# EasyEDA schematic SCH_gibran_2026-04-14.json
TITLE: gibran; REV: 1.0; Date: 2026-03-31; Sheet: 1/1; Company: teknik elektro
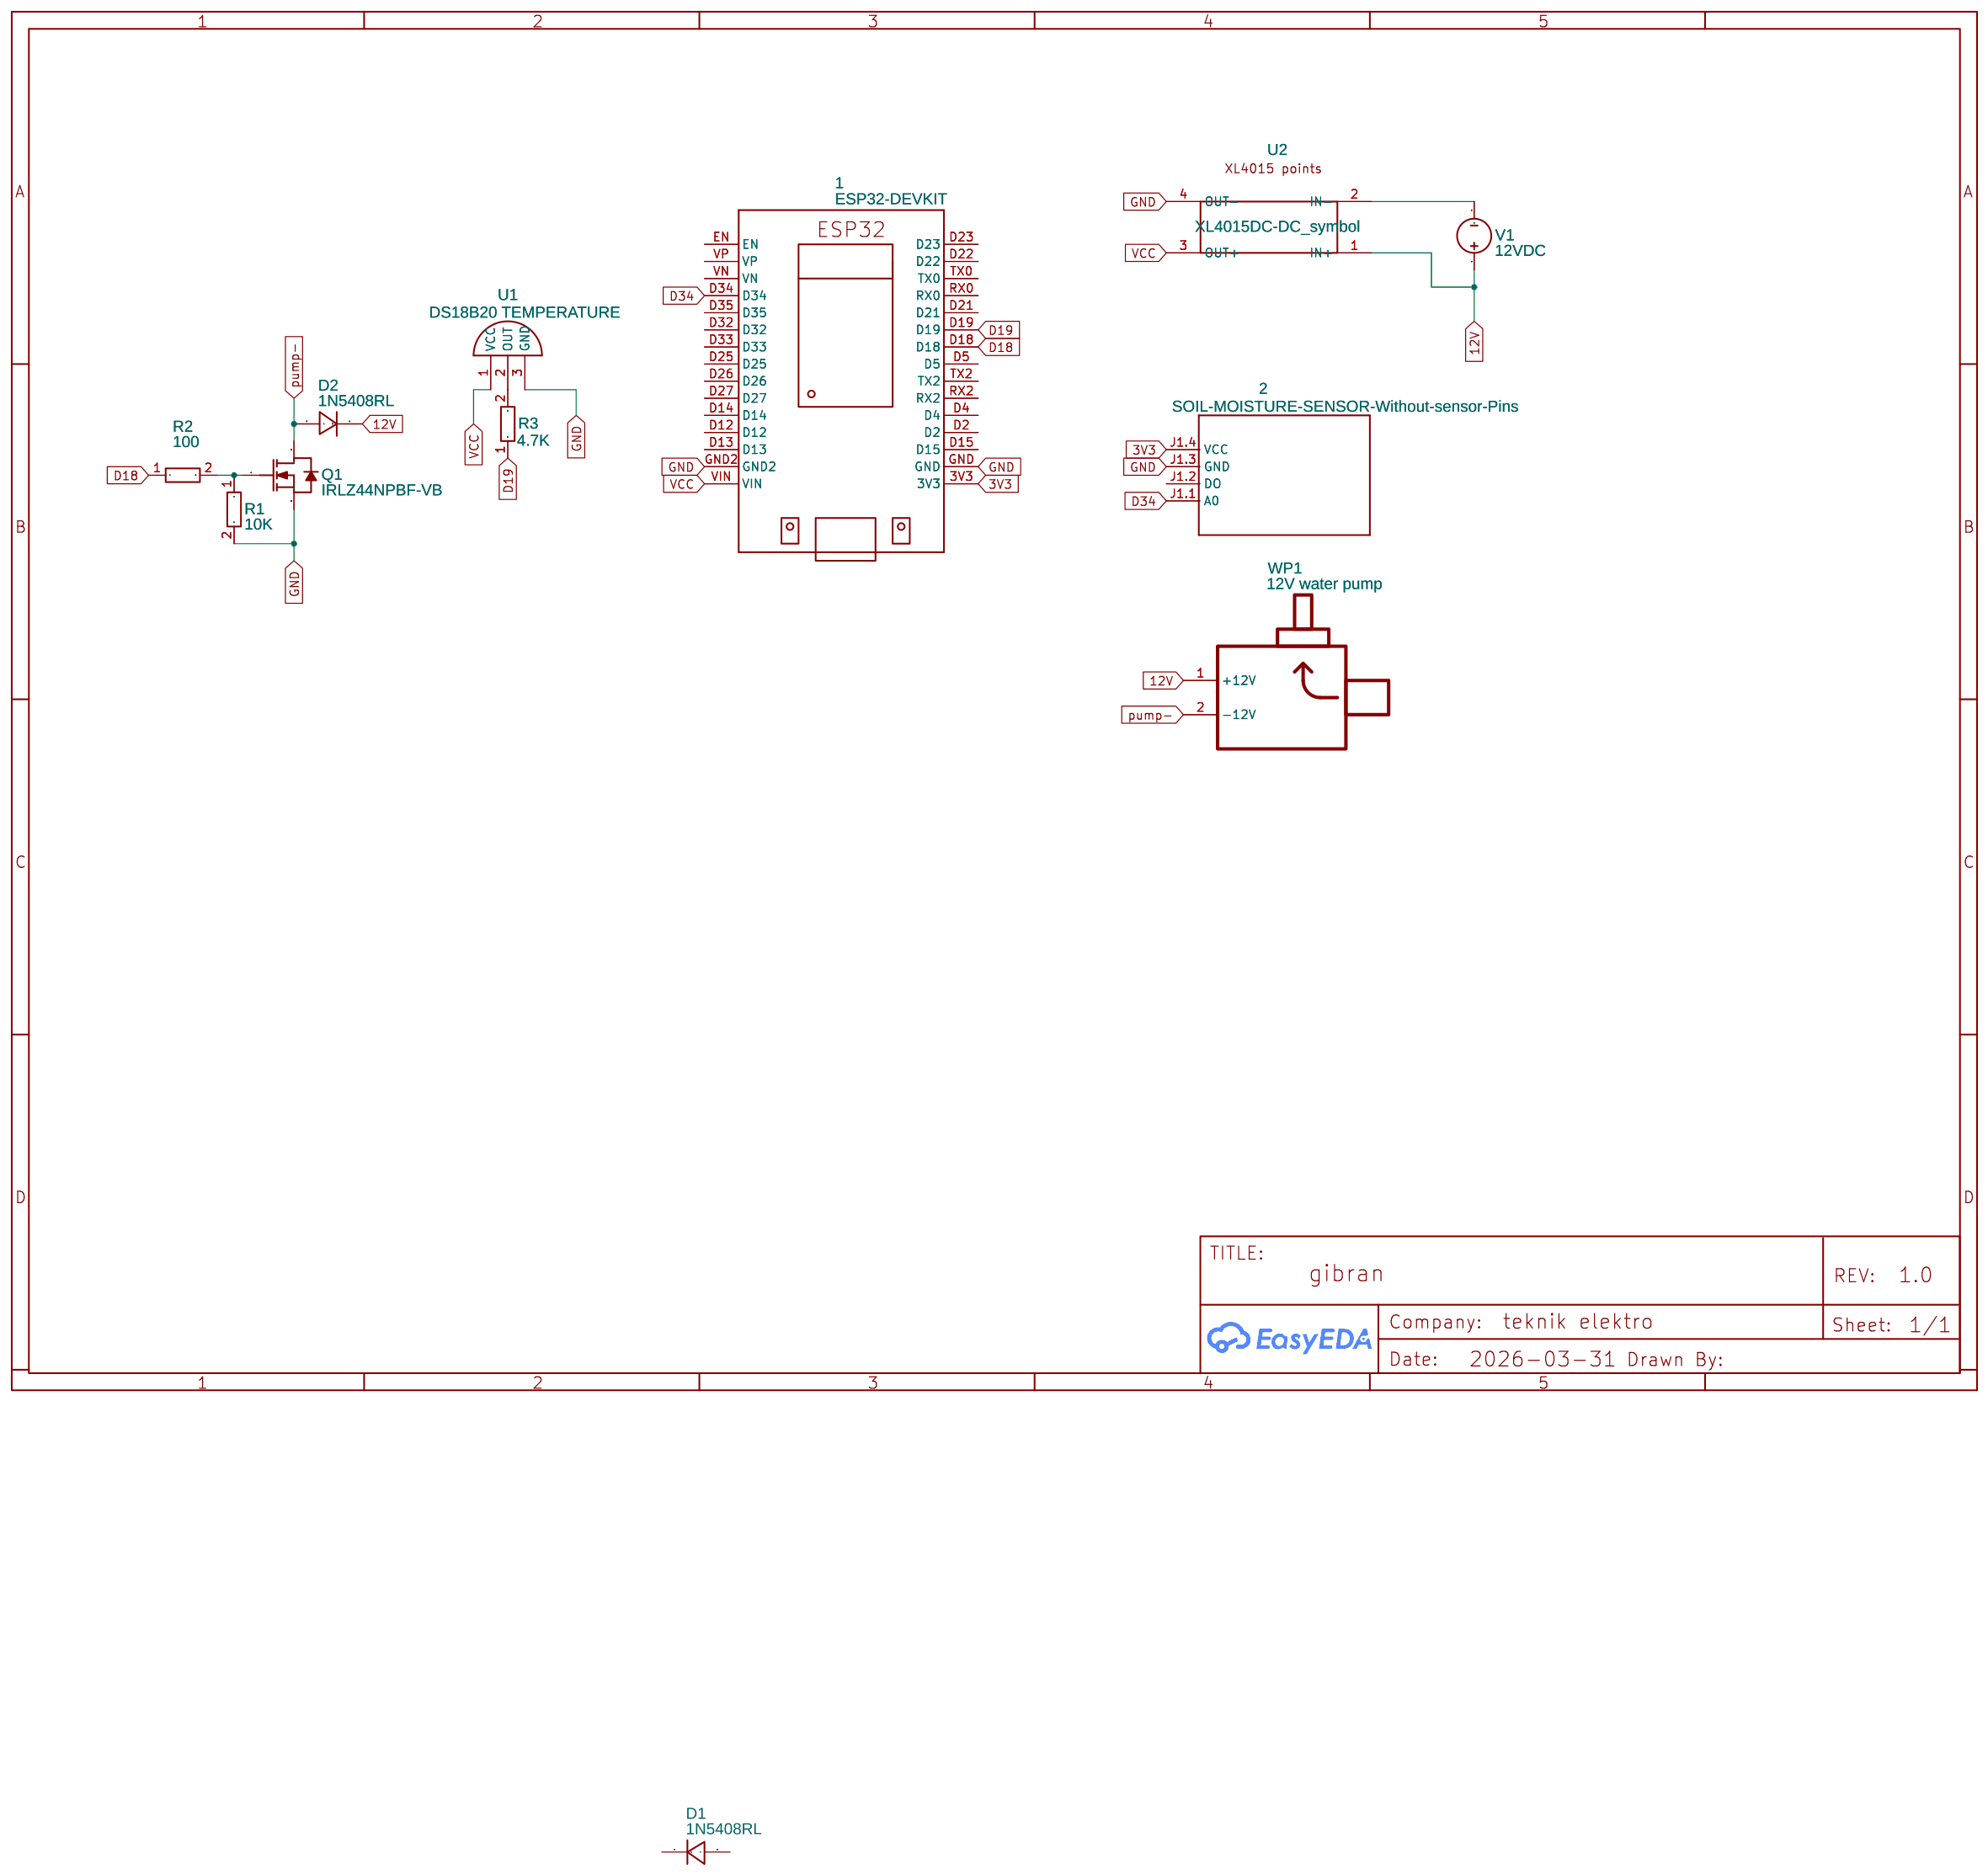
[diagram p0: schematic sheet]

## Parts
1  ESP32-DEVKIT  [ESP32-DEVKITV1_ESP32-DEVKITV1]
2  SOIL-MOISTURE-SENSOR-Without-sensor-Pins  [SOIL-MOISTURE-SENSOR-WITHOUT-SENSOR-PINS]
D1  1N5408RL  [DO-201AD_BD5.3-L8.4-P12.50-D1.4-RD]
D2  1N5408RL  [DO-201AD_BD5.3-L8.4-P12.50-D1.4-RD]
Q1  IRLZ44NPBF-VB  [TO-220-3_L10.0-W4.5-P2.54-L-2]
R1  10K  [10K-R-THT-FP]
R2  100  [10K-R-THT-FP]
R3  4.7K  [10K-R-THT-FP]
U1  DS18B20 TEMPERATURE  [DS18B20]
U2  XL4015DC-DC_symbol  [XL4015DC-DC]
V1  12VDC  [HDR1X2]
WP1  12V water pump  [PUMP FOOTPRNT]

## Library data of the parts
1 = ESP32-DEVKIT-V1-30PIN: Contributor: ppippospinello
2 = SOIL-MOISTURE-SENSOR-Without-sensor-Pins: Contributor: rongarcia
D1 D2 = 1N5408RL: Standard Recovery Rectifier, 2-Pin Axial_Lead, Pb-Free, Tape and Reel
Q1 = IRLZ44NPBF-VB: Supplier: LCSC; Supplier Part: C20755022; Manufacturer: VBsemi(微碧半导体); JLCPCB Part Class: Extended Part; Contributor: lcsc
R1-R3 = 10K-R-THT: Contributor: LCSC; Supplier: LCSC; Supplier Part: C119313; Manufacturer: CCO(千志电子); Manufacturer Part: MF1/4W-330Ω±1% T; JLCPCB Part Class: Extended Part
U1 = DS18B20 TEMPERATURE: Manufacturer Part: New SchematicLib; Contributor: felixzhdanov
U2 = XL4015DC-DC_symbol: Contributor: to_ttpro
V1 = POWER_SUPPLY_12V COPY COPY: Contributor: Ajnevs
WP1 = 12V water pump: Contributor: Jan Dłużewski

## Nets
3V3: 1.3V3 2.J1.4(VCC)
12V: D2.1(C) U2.1(IN+) V1.1 WP1.1(+12V)
GND: 1.GND 1.GND2 2.J1.3(GND) Q1.3(S) R1.2 U1.3(GND) U2.4(OUT-)
VCC: 1.VIN U1.1(VCC) U2.3(OUT+)
D18: 1.D18 R2.1
D19: 1.D19 R3.1
D34: 1.D34 2.J1.1(A0)
pump-: D2.2(A) Q1.2(D) WP1.2(-12V)
Net-(Q1-1): Q1.1(G) R1.1 R2.2
Net-(R3-2): R3.2 U1.2(OUT)
Net-(U2-2): U2.2(IN-) V1.2

Not connected (* = marked no-connect by the designer): 1 D2 D4 D5 D12 D13 D14 D15 D21 D22 D23 D25 D26 D27 D32 D33 D35 EN RX0 RX2 TX0 TX2 VN VP; 2 J1.2(DO); D1 1(C) 2(A)
